# Altium schematic sheet Backup.SchDoc
size A
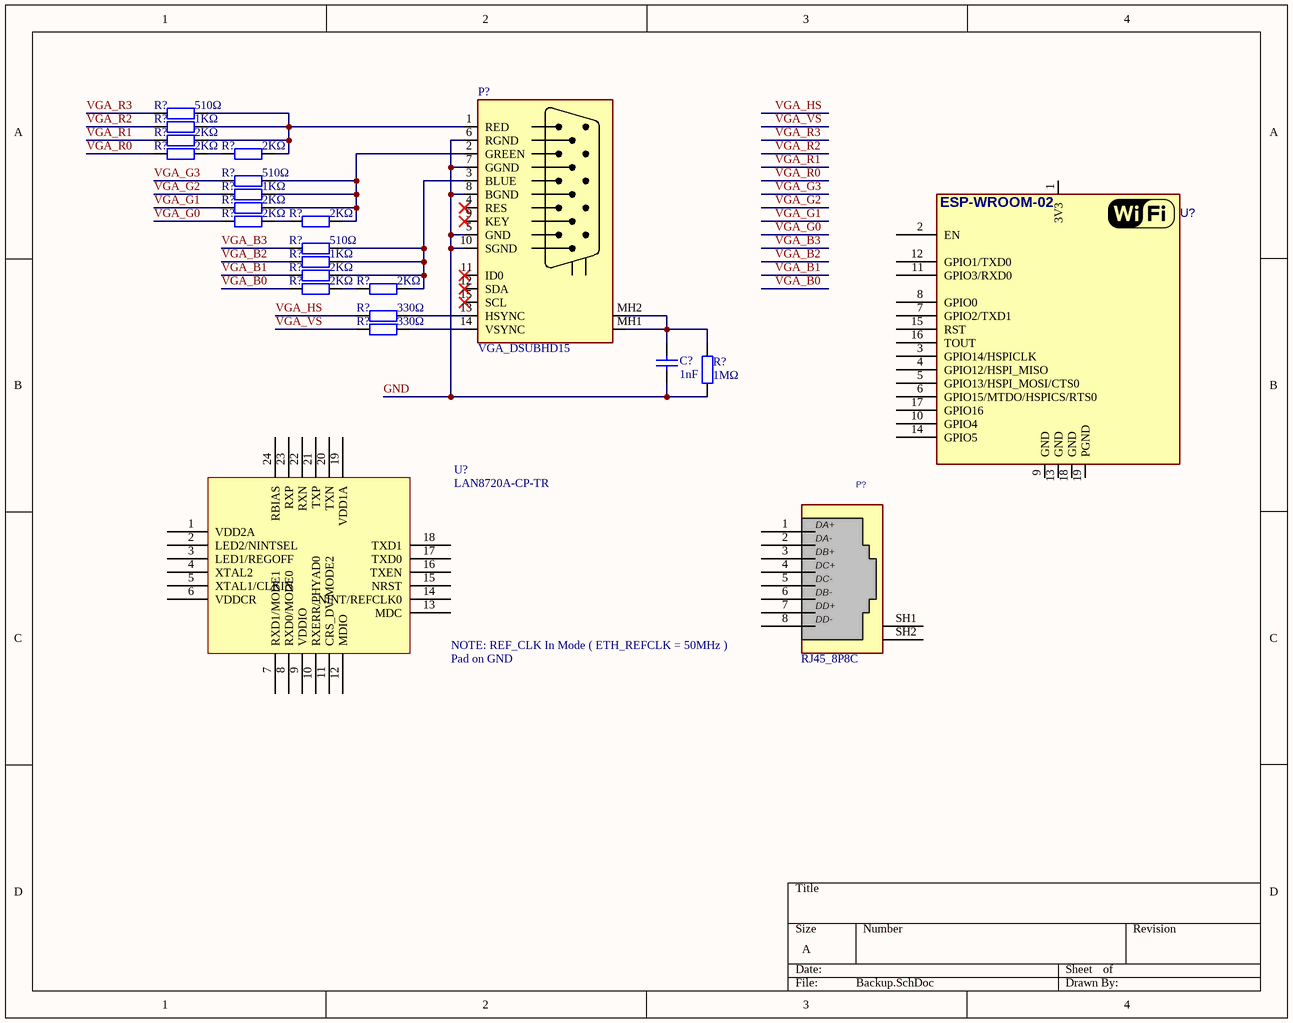
[diagram p0: Backup.SchDoc]

## Parts
(Parts that share a designator on the sheet are numbered #1, #2 ... from top to bottom, then left to right.)
C?  1nF  [0805_C]
P?#1  VGA_DSUBHD15  [DSUBHD_15RF]
P?#2  RJ45_8P8C  [RJ45_8S_RA_TU]
R?#1  510Ω  [0805_R]
R?#2  1KΩ  [1206_R]
R?#3  2KΩ  [0805_R]
R?#4  2KΩ  [0805_R]
R?#5  2KΩ  [0805_R]
R?#6  510Ω  [0805_R]
R?#7  1KΩ  [1206_R]
R?#8  2KΩ  [0805_R]
R?#9  2KΩ  [0805_R]
R?#10  2KΩ  [0805_R]
R?#11  510Ω  [0805_R]
R?#12  1KΩ  [1206_R]
R?#13  2KΩ  [0805_R]
R?#14  2KΩ  [0805_R]
R?#15  2KΩ  [0805_R]
R?#16  330Ω  [0805_R]
R?#17  330Ω  [0805_R]
R?#18  1MΩ  [0805_R]
U?#1  ESP-WROOM  [ESP8266_ESPW2]  (value not drawn)
U?#2  LAN8720A-CP-TR  [QFN-24_4x4x05P]

## Nets
GND: C?.1 P?#1.5(GND) P?#1.6(RGND) P?#1.7(GGND) P?#1.8(BGND) P?#1.10(SGND) R?#18.1
VGA_B0: R?#14.1
VGA_B1: R?#13.1
VGA_B2: R?#12.1
VGA_B3: R?#11.1
VGA_G0: R?#9.1
VGA_G1: R?#8.1
VGA_G2: R?#7.1
VGA_G3: R?#6.1
VGA_HS: R?#16.1
VGA_R0: R?#4.1
VGA_R1: R?#3.1
VGA_R2: R?#2.1
VGA_R3: R?#1.1
VGA_VS: R?#17.1
NetC?_2: C?.2 P?#1.MH1 P?#1.MH2 R?#18.2
NetP?#1_1: P?#1.1(RED) R?#1.2 R?#2.2 R?#3.2 R?#5.2
NetP?#1_2: P?#1.2(GREEN) R?#6.2 R?#7.2 R?#8.2 R?#10.2
NetP?#1_3: P?#1.3(BLUE) R?#11.2 R?#12.2 R?#13.2 R?#15.2
NetP?#1_13: P?#1.13(HSYNC) R?#16.2
NetP?#1_14: P?#1.14(VSYNC) R?#17.2
NetR?#4_2: R?#4.2 R?#5.1
NetR?#9_2: R?#9.2 R?#10.1
NetR?#14_2: R?#14.2 R?#15.1

Not connected (* = marked no-connect by the designer): P?#1 4(RES)* 9(KEY)* 11(ID0)* 12(SDA)* 15(SCL)*; P?#2 1(DA+) 2(DA-) 3(DB+) 4(DC+) 5(DC-) 6(DB-) 7(DD+) 8(DD-) SH1 SH2; U?#1 1(3V3) 2(EN) 3(GPIO14/HSPICLK) 4(GPIO12/HSPI_MISO) 5(GPIO13/HSPI_MOSI/CTS0) 6(GPIO15/MTDO/HSPICS/RTS0) 7(GPIO2/TXD1) 8(GPIO0) 9(GND) 10(GPIO4) 11(GPIO3/RXD0) 12(GPIO1/TXD0) 13(GND) 14(GPIO5) 15(RST) 16(TOUT) 17(GPIO16) 18(GND) 19(PGND); U?#2 1(VDD2A) 2(LED2/NINTSEL) 3(LED1/REGOFF) 4(XTAL2) 5(XTAL1/CLKIN) 6(VDDCR) 7(RXD1/MODE1) 8(RXD0/MODE0) 9(VDDIO) 10(RXERR/PHYAD0) 11(CRS_DV/MODE2) 12(MDIO) 13(MDC) 14(NINT/REFCLK0) 15(NRST) 16(TXEN) 17(TXD0) 18(TXD1) 19(VDD1A) 20(TXN) 21(TXP) 22(RXN) 23(RXP) 24(RBIAS)

## Notes on the sheet
- (near U?#2) NOTE: REF_CLK In Mode ( ETH_REFCLK = 50MHz )
- (near U?#2) Pad on GND

## Library data of the parts
C? = 0805 1nF (102) 10% 50V: 贴片电容; ComponentLink1Description: 供应商链接; ComponentLink1URL: http://www.szlcsc.com/product/details_52223.html; Package: 0805; Supplier: LC; SuppliersPartNumber: C51210
P?#1 = CONN_VGA_DSUBHD15: CONN, VGA, DSUB, HD, 15PIN, R/A, FEMALE, THD; MANF_P#: -; MANF: -; VALUE: VGA_DSUBHD15
P?#2 = RJ45_8S_RA_TU: RJ45, 8P, SHIELDED, RightAngle, TabUP; MANF: WURTH; MANF_P#: 615008140621; PRICE: 1.2$; VALUE: RJ45_8P8C
R?#1 R?#6 R?#11 = 0805 510Ω (5100) 1%: 贴片电阻; ComponentLink1Description: 供应商链接; ComponentLink1URL: http://www.szlcsc.com/product/details_18422.html; Package: 0805; Supplier: LC; SuppliersPartNumber: C17734
R?#2 R?#7 R?#12 = 1206 1KΩ (1001) 1%: 贴片电阻; ComponentLink1Description: 供应商链接; ComponentLink1URL: http://www.szlcsc.com/product/details_4817.html; Package: 1206; Supplier: LC; SuppliersPartNumber: C4410
R?#3-R?#5 R?#8-R?#10 R?#13-R?#15 = 0805 2KΩ (2001) 1%: 贴片电阻; ComponentLink1Description: 供应商链接; ComponentLink1URL: http://www.szlcsc.com/product/details_18292.html; Package: 0805; Supplier: LC; SuppliersPartNumber: C17604
R?#16 R?#17 = 0805 330Ω (3300) 1%: 贴片电阻; ComponentLink1Description: 供应商链接; ComponentLink1URL: http://www.szlcsc.com/product/details_18318.html; Package: 0805; Supplier: LC; SuppliersPartNumber: C17630
R?#18 = 0805 1MΩ (1004) 1%: 贴片电阻; ComponentLink1Description: 供应商链接; ComponentLink1URL: http://www.szlcsc.com/product/details_18202.html; Package: 0805; Supplier: LC; SuppliersPartNumber: C17514
U?#1 = ESP8266_WROOM02: ESP8266 ESP-12 Wi-Fi Module; MANF: Espressif; MANF_P#: ESP-WROOM-02; VALUE: ESP-WROOM
U?#2 = MPU-6050_[C24112]: Ethernet Chip QFN24; ComponentLink1Description: 供应商链接; ComponentLink1URL: http://www.szlcsc.com/product/details_24852.html; Package: QFN-24_4x4x05P; Supplier: LC; SuppliersPartNumber: C24112